# Altium schematic sheet Power.SchDoc
size 279 x 215 mm; SheetNumber: 3; SheetTotal: 10
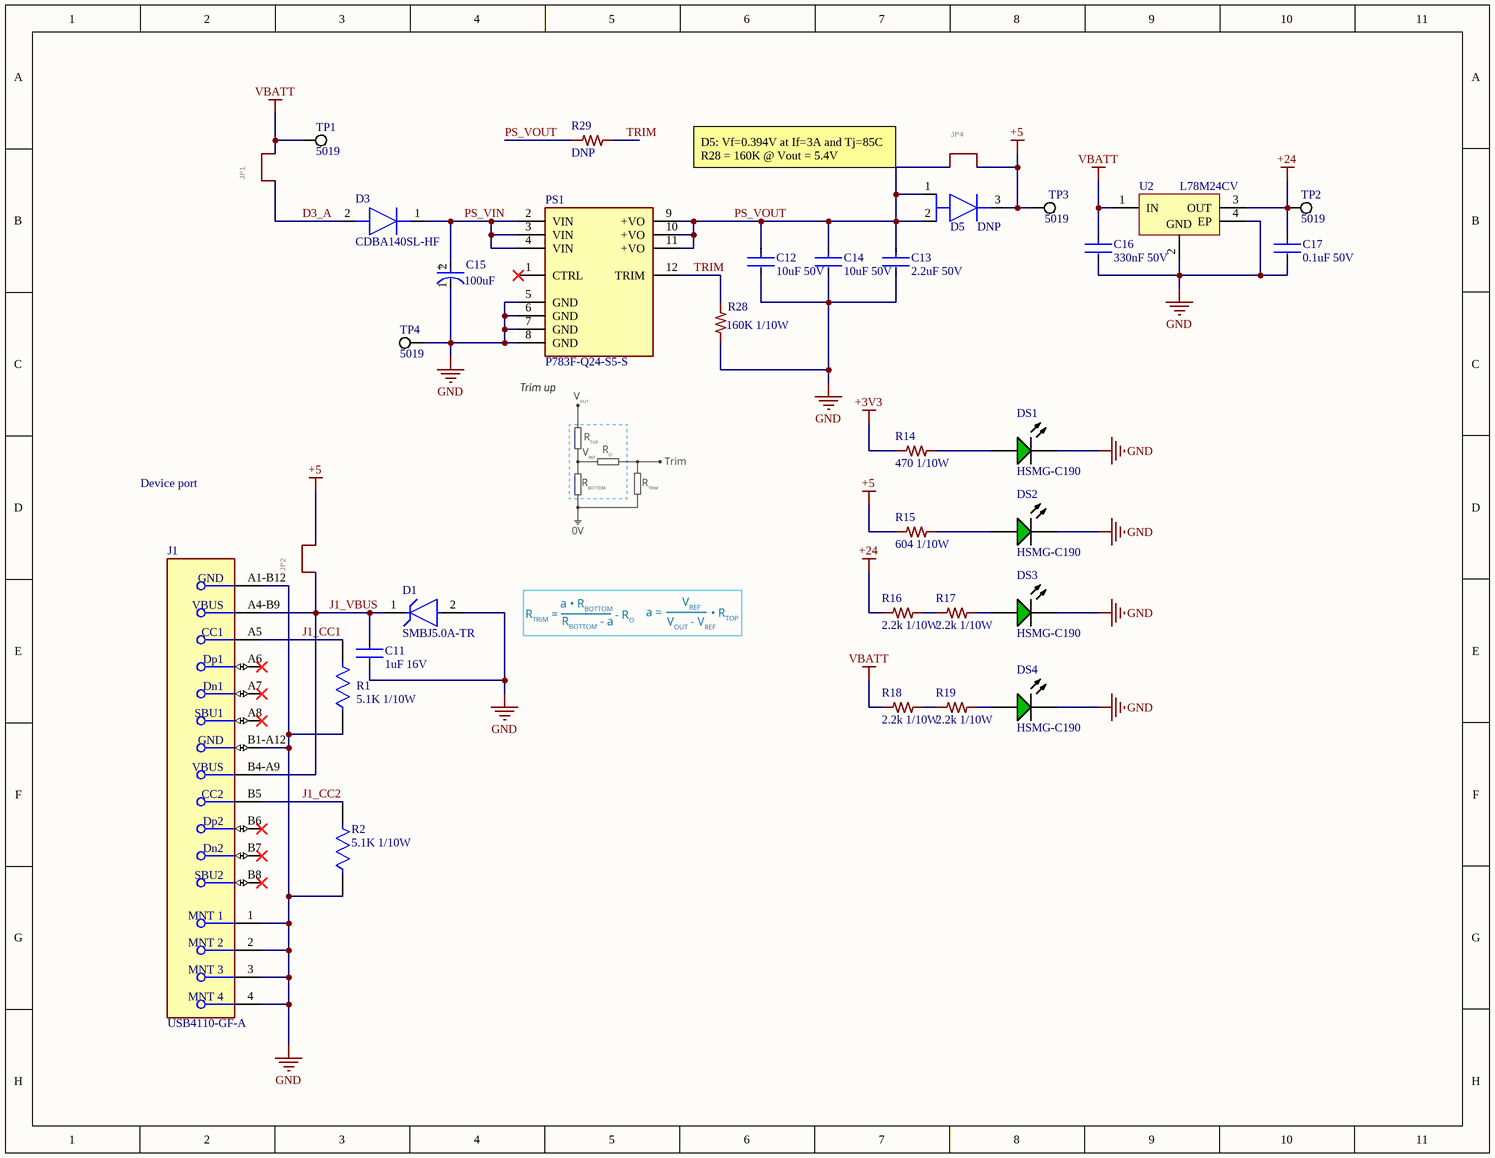
[diagram p0: Power.SchDoc]

## Parts
C11  1uF 16V  [CAPACITOR_0603]
C12  10uF 50V  [FP-GRM21B-0_2-e0_2_0_7-IPC_A]
C13  2.2uF 50V  [CAPACITOR_0603]
C14  10uF 50V  [FP-GRM21B-0_2-e0_2_0_7-IPC_A]
C15  Capacitance: 100uF  [FP-UWT1H101MNL1GS-MFG]  (hidden comment: UWT1H101MNL1GS)
C16  330nF 50V  [CAPACITOR_0603]
C17  0.1uF 50V  [CAPACITOR_0603]
D1  SMBJ5.0A-TR  [FP-SMB-MFG]
D3  CDBA140SL-HF  [DIOM5225X250N]
D5  PMEG045T050EPDZ  [PMEG060V100EPDZ]  (value not drawn)
DS1  HSMG-C190  [AVAG-HSMX-C190_V]
DS2  HSMG-C190  [AVAG-HSMX-C190_V]
DS3  HSMG-C190  [AVAG-HSMX-C190_V]
DS4  HSMG-C190  [AVAG-HSMX-C190_V]
J1  USB4110-GF-A  [FP-USB4110-GF-A-MFG]
JP1  TSM-102-01-L-SV  [FP-TSM-102-01-L-SV-P-TR-MFG]  (value not drawn)
JP2  TSM-102-01-L-SV  [FP-TSM-102-01-L-SV-P-TR-MFG]  (value not drawn)
JP4  CRCW12100000Z0EA  [FP-RMCF1210-IPC_B]  (value not drawn)
PS1  P783F-Q24-S5-S  [CONV_P783F-Q24-S5-S]
R1  5.1K 1/10W  [0603R]
R2  5.1K 1/10W  [0603R]
R14  470 1/10W  [0603R]
R15  604 1/10W  [0603R]
R16  2.2k 1/10W  [0603R]
R17  2.2k 1/10W  [0603R]
R18  2.2k 1/10W  [0603R]
R19  2.2k 1/10W  [0603R]
R28  160K 1/10W  [0603R]
R29  (no value)  [0603R]
TP1  5019  [KSTN-5019_V]
TP2  5019  [KSTN-5019_V]
TP3  5019  [KSTN-5019_V]
TP4  5019  [KSTN-5019_V]
U2  L78M24CV  [TO-220]

## Nets
+3V3: R14.1
+5: D5.3(K) JP2.2 JP4.2 R15.1 TP3.1
+24: C17.2 R16.1 TP2.1 U2.3(OUT)
GND: C11.1 C12.2 C13.2 C14.2 C15.1(C) C16.1 C17.1 D1.2(A) DS1.2(K) DS2.2(K) DS3.2(K) DS4.2(K) J1.1(MNT_1) J1.2(MNT_2) J1.3(MNT_3) J1.4(MNT_4) J1.A1-B12(GND) J1.B1-A12(GND) PS1.5(GND) PS1.6(GND) PS1.7(GND) PS1.8(GND) R1.1 R2.1 R28.1 TP4.1 U2.2(GND) U2.4(EP)
VBATT: C16.2 JP1.2 R18.1 TP1.1 U2.1(IN)
D3_A: D3.2(A) JP1.1
J1_CC1: J1.A5(CC1) R1.2
J1_CC2: J1.B5(CC2) R2.2
J1_VBUS: C11.2 D1.1(K) J1.A4-B9(VBUS) J1.B4-A9(VBUS) JP2.1
PS_VIN: C15.2(A) D3.1(K) PS1.2(VIN) PS1.3(VIN) PS1.4(VIN)
PS_VOUT: C12.1 C13.1 C14.1 D5.1(A) D5.2(A) JP4.1 PS1.9(+VO) PS1.10(+VO) PS1.11(+VO) R29.2
TRIM: PS1.12(TRIM) R28.2 R29.1
NetDS1_1: DS1.1(A) R14.2
NetDS2_1: DS2.1(A) R15.2
NetDS3_1: DS3.1(A) R17.2
NetDS4_1: DS4.1(A) R19.2
NetR16_2: R16.2 R17.1
NetR18_2: R18.2 R19.1

Not connected (* = marked no-connect by the designer): J1 A6(Dp1)* A7(Dn1)* A8(SBU1)* B6(Dp2)* B7(Dn2)* B8(SBU2)*; PS1 1(CTRL)*

## Notes on the sheet
- D5: Vf=0.394V at If=3A and Tj=85C
  R28 = 160K @ Vout = 5.4V
- Device port
- (in symbol CMP-2000-07373-2) +

## Library data of the parts
C11 = CL10A105KO8NNNC: CAP CER 1UF 16V X5R 0603; MFR: Samsung Electro-Mechanics; MPN: CL10A105KO8NNNC
C12 C14 = CMP-06035-004402-1: Chip Multilayer Ceramic Capacitors for General Purpose, 0805, 10uF, X5R, 15%, 10%, 50V; MPN: GRM21BR61H106KE43L; MFR: Murata Electronics; Voltage Rating (DC): 50V; Dielectric: X5R; Tolerance: 10%; Capacitance: 10uF; Thickness: 1.25mm; Length: 2mm; Width: 1.25mm
C13 = GRT188R61H225KE13D: CAP CER 2.2UF 50V X5R 0603; MFR: Murata Electronics; Tolerance: 10%; Case Code (Metric): 1608; Voltage Rating: 50V; Thickness: 0.035inch; Min Operating Temperature: -55°C; Length: 0.063inch; Case/Package: 0603; Mount: Surface Mount; Max Operating Temperature: 85°C; Capacitance: 2.2uF; Dielectric: X5R; Voltage Rating (DC): 50V; Ratings: AEC-Q200; Width: 0.031inch; Case Code (Imperial): 0603; Packaging: Tape and Reel; MPN: GRT188R61H225KE13D
C15 = CMP-2000-07373-2: CAP ALUM 100UF 20% 50V SMD; MFR: Nichicon; Leakage Current: 3uA; Ripple Current: 140mA; Life (Hours): 1000Hour; Dissipation Factor: 0.14%; Dielectric Material: Aluminium; Termination: SMD/SMT; Tolerance: 20%; Package Quantity: 500; Height: 10mm; REACH SVHC: No SVHC; Case/Package: Radial; Series: WT; Diameter: 8mm; Voltage Rating: 50V; Construction: Cylindrical; Length: 10mm; Min Operating Temperature: -55°C; Max Operating Temperature: 105°C; Voltage Rating (DC): 50V; Packaging: Tape and Reel; Voltage: 50V; Mount: Surface Mount; Ripple Current (AC): 140mA; Radiation Hardening: No; Number of Pins: 2; Lead Free: Lead Free; Height - Seated (Max): 0.413inch; RoHS Compliant: Yes; MPN: UWT1H101MNL1GS
C16 = C1608X7R1H334K080AC: CAP CER 0.33UF 50V X7R 0603; MFR: TDK Corporation; Tolerance: 10%; Dielectric Material: Ceramic; Capacitance: 330nF; Case Code (Imperial): 0603; Case Code (Metric): 1608; Dielectric: X7R; Length: 1.6mm; Construction: Flat; Resistor Type: Ceramic; Mount: Surface Mount; Voltage Rating: 50V; Packaging: Tape and Reel; Series: C; Case/Package: 0603; Lead Free: Lead Free; Voltage: 50V; REACH SVHC: No SVHC; Height: 0.8mm; Weight: 7.1E-05oz; Termination: SMD/SMT; Max Operating Temperature: 125°C; RoHS Compliant: Yes; Min Operating Temperature: -55°C; Depth: 0.8mm; Package Quantity: 1; Thickness: 0.037inch; Voltage Rating (DC): 50V; Width: 0.031inch; MPN: C1608X7R1H334K080AC
C17 = CL10B104KB8NNWC: CAP CER 0.1UF 50V X7R 0603; MFR: Samsung Electro-Mechanics; MPN: CL10B104KB8NNWC
D1 = SMBJ5.0A-TR: TVS DIODE 5V 13.4V SMB; MFR: STMicroelectronics; Number Of Channels: 1; Peak Pulse Power: 600W; Clamping Voltage: 14.4V; Standoff Height: 0.05mm; Peak Pulse Current: 275A; Max Junction Temp: +150°C; Direction: Unidirectional; Device Class L3: unset; Mouser Description: SMBJ Series 600 W 5 V Uni Directional SMT TVS Diode - DO-214AA; Lead Free: Yes; ComponentLink2URL: https://www.st.com/resource/en/datasheet/smbj.pdf; Package: SMB; Reverse Standoff Voltage: 5V; Device Class L1: Circuit Protection; RoHS: TRUE; Temperature Range Low: -55°C; Category: Diode; MPN: SMBJ5.0A-TR; Digikey Description: TVS DIODE 5V 13.4V SMB; Height: 2.65mm; Temperature Range High: +150°C; Octopart: https://octopart.com/smbj5.0a-tr-stmicroelectronics-347079; Device Class L2: TVS Diodes; ComponentLink2Description: Datasheet; Temperature: -55°C to +150°C
D3 = CDBA140SL-HF: DIODE SCHOTTKY 40V 1.4A DO214AC; Manufacturer_Name: Comchip Technology; Datasheet Link: http://www.mouser.com/ds/2/80/CDBA140SL-HF RevC729463-766397.pdf; Height: 2.5mm; MPN: CDBA140SL-HF; Mouser Part Number: 750-CDBA140SL-HF; Mouser Price/Stock: https://www.mouser.co.uk/ProductDetail/Comchip-Technology/CDBA140SL-HF?qs=2qJf6qQ4IOIs6CdtgpGzGA%3D%3D; Arrow Part Number: CDBA140SL-HF; MFR: Comchip Technology
D5 = PMEG045T050EPDZ: DIODE SCHOTTKY 45V 5A CFP15; MFR: Nexperia USA Inc.; DNP: DNP; MPN: PMEG045T050EPDZ
DS1-DS4 = HSMG-C190: Chip LED, Green, 2.2 V, -40 to 85 degC, 2-Pin SMD, RoHS, Tape and Reel; MFR: Broadcom Limited; Frequency: 400 KHz; Max Supply Voltage: 5.5 V; Clock Frequency: 100 KHz; Case\Package: SOIC; Density: 32 kb; Nominal Supply Current: 2 mA; Interface: Serial; Min Supply Voltage: 1.7 V; Packaging: Tape and Reel; MPN: HSMG-C190; ComponentLink2URL: http://docs.avagotech.com/docs/AV02-0551EN; RoHSCompliant: true; Pins: 8; REACH SVHC: No SVHC; Max Operating Temperature: 85 degC; Width: 4 mm; Radiation Hardening: No; Package Quantity: 3000; ComponentLink3Description: Package Specification; ComponentLink1Description: Manufacturer URL; Min Operating Temperature: -40 degC; PackageDescription: 2-Pin Surface Mount Device, Body 1.6 x 0.8 mm, Height 0.9 mm; Max Clock Frequency: 100 KHz; Height: 1.5 mm; ComponentLink1URL: http://www.avagotech.com/; DatasheetVersion: Mar-12; ComponentLink2Description: Datasheet; Mount: Surface Mount; Length: 5 mm; ComponentLink3URL: http://www.fairchildsemi.com/dwg/MA/MA03D.pdf
J1 = USB4110-GF-A: CONN USB 2.0 TYPE-C R/A SMT; Manufacturer: GCT; Conn Orientation: Right Angle; Usb Standard: USB 2.0; Voltage Rating: 20V; Current Rating: 3/4.25/1.25/0.25A; Number Of Contacts: 16; Is Female: yes; Shielding: true; Standoff Height: 0.1mm; Octopart: https://octopart.com/usb4110-gf-a-gct-103941985; Temperature: -40°C to +85°C; RoHS: TRUE; Contact Material: Gold,Nickel; Device Class L1: Connectors; Device Class L2: USB Connectors; Package: 0; Lead Free: Yes; ComponentLink2URL: https://gct.co/files/drawings/usb4110.pdf; Temperature Range High: +85°C; Temperature Range Low: -40°C; Height: 3.46mm; ComponentLink2Description: Datasheet; Device Class L3: unset; Digikey Description: CONN USB 2.0 TYPE-C R/A SMT; Category: Conn; MPN: USB4110-GF-A; MFR: GCT
JP1 JP2 = JUMPER_?_SMD_2POS: CONN HEADER SMD 2POS 2.54MM; MANUFACTURER: Samtec Inc.; GateName_1: G$1; SymbolName_1: JUMPER; MPN: TSM-102-01-L-SV; MFR: Samtec Inc.
JP4 = JUMPER_?_1210: RES JUMPER SMD 0 OHM JUMPER 1/2W 1210; MANUFACTURER: Vishay Dale; GateName_1: G$1; SymbolName_1: JUMPER; MPN: CRCW12100000Z0EA; MFR: Vishay Dale
PS1 = P783F-Q24-S5-S: DC DC CONVERTER 5V 15W; MFR: CUI; MPN: P783F-Q24-S5-S; Package: None; Price: None; Value: *
R1 R2 = ERA-3AEB512V: RES SMD 5.1K OHM 0.1% 1/10W 0603; MFR: Panasonic Electronic Components; MFR PN: ERA-3AEB512V; MPN: ERA-3AEB512V
R14 = ERA-3AEB471V: RES SMD 470 OHM 0.1% 1/10W 0603; MANUFACTURER: Panasonic Electronic Components; GateName_1: G$1; SymbolName_1: RESISTOR; DeviceName: 0603; DPKN: *; MPN: ERA-3AEB471V; POWER: *; VOLTAGE_CONTINUOUS: *; VOLTAGE_MAX: *; RESISTANCE: *; MFR: Panasonic Electronic Components
R15 = RMCF0603FT604R: RES SMD 604 OHM 1% 1/10W 0603; MANUFACTURER: Stackpole Electronics Inc; GateName_1: G$1; SymbolName_1: RESISTOR; DeviceName: 0603; DPKN: *; MPN: RMCF0603FT604R; POWER: *; VOLTAGE_CONTINUOUS: *; VOLTAGE_MAX: *; RESISTANCE: *; MFR: Stackpole Electronics Inc
R16-R19 = RT0603BRD072K2L: RES SMD 2.2K OHM 0.1% 1/10W 0603; MANUFACTURER: YAGEO; GateName_1: G$1; SymbolName_1: RESISTOR; DeviceName: 0603; DPKN: *; MPN: RT0603BRD072K2L; POWER: *; VOLTAGE_CONTINUOUS: *; VOLTAGE_MAX: *; RESISTANCE: *; MFR: YAGEO
R28 = RT0603BRD07160KL: RES SMD 160K OHM 0.1% 1/10W 0603; MANUFACTURER: Stackpole Electronics Inc; MPN: RMCF0603FT604R; GateName_1: G$1; SymbolName_1: RESISTOR; DeviceName: 0603; DPKN: *; POWER: *; VOLTAGE_CONTINUOUS: *; VOLTAGE_MAX: *; RESISTANCE: *; MFR: Stackpole Electronics Inc
R29 = RESISTOR_0603: RES SMD CUSTOM 0603; GateName_1: G$1; DeviceName: 0603; SymbolName_1: RESISTOR; DPKN: *; MANUFACTURER: *; MOPN: *; MPN: -; POWER: *; VOLTAGE_CONTINUOUS: *; VOLTAGE_MAX: *; RESISTANCE: *; DNP: DNP
TP1-TP4 = CMP-1672-00008-1: Test Point, 1 Position SMD, RoHS, Tape and Reel; MFR: Keystone Electronics; ComponentLink1Description: Manufacturer URL; Package Quantity: 1000; DatasheetVersion: 03/2014; Packaging: Tape and Reel; ComponentLink2URL: http://www.keyelco.com/product-pdf.cfm?p=1357; ComponentLink1URL: http://www.keyelco.com/; Mount: Surface Mount; Contact Plating: Silver; PackageDescription: 1-Pin Surface Mount Device, Body 3.81 x 2.03 mm; Pins: 1; RoHSCompliant: True; Mounting Technology: Surface Mount; ComponentLink2Description: Datasheet; MPN: 5019
  TP2 TP3: PackageReference: 5019
U2 = L78M24CV: Positive Voltage Regulator, 15V, 3-Pin TO-220; MFR: STMicroelectronics; ComponentLink2URL: http://www.st.com/internet/com/TECHNICAL_RESOURCES/TECHNICAL_LITERATURE/DATASHEET/CD00000447.pdf; ComponentLink3Description: Package Specification; DatasheetVersion: 1/11/2010; ComponentLink2Description: Datasheet; PackageVersion: ver3.0; ComponentLink1URL: http://www.st.com; ComponentLink3URL: http://www.st.com/internet/com/TECHNICAL_RESOURCES/TECHNICAL_LITERATURE/PACKAGE_INFORMATION/CD00004649.pdf; PackageReference: TO220; ComponentLink1Description: Manufacturer URL; PackageDescription: TO, Thru-Hole, Vertical, Heatsink Mounted; 3 In-Line Leads; Pitch 2.54 mm; MPN: L78M24CV